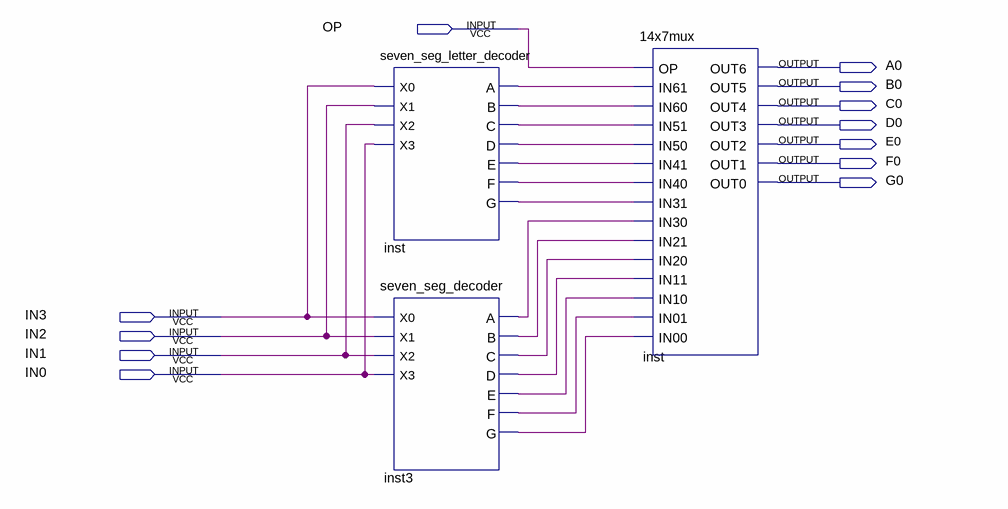
[diagram p0: schematic sheet]
// Quartus schematic 4BitDisplay.bdf as structural Verilog: 3 symbols, 12 pins
module \4BitDisplay  (
  input  OP,
  input  IN3,
  input  IN2,
  input  IN1,
  input  IN0,
  output A0,
  output B0,
  output C0,
  output D0,
  output E0,
  output F0,
  output G0
);

  wire inst3_a, inst3_b, inst3_c, inst3_d, inst3_e, inst3_f, inst3_g, inst_a, inst_b, inst_c, inst_d, inst_e,
       inst_f, inst_g;

  seven_seg_letter_decoder inst (
    .X0(IN3), .X1(IN2), .X2(IN1), .X3(IN0), .A(inst_a), .B(inst_b), .C(inst_c), .D(inst_d), .E(inst_e),
    .F(inst_f), .G(inst_g));
  seven_seg_decoder inst3 (
    .X0(IN3), .X1(IN2), .X2(IN1), .X3(IN0), .A(inst3_a), .B(inst3_b), .C(inst3_c), .D(inst3_d), .E(inst3_e),
    .F(inst3_f), .G(inst3_g));
  \14x7mux  inst_dup2 (
    .OP(OP), .IN61(inst_a), .IN60(inst_b), .IN51(inst_c), .IN50(inst_d), .IN41(inst_e), .IN40(inst_f),
    .IN31(inst_g), .IN30(inst3_a), .IN21(inst3_b), .IN20(inst3_c), .IN11(inst3_d), .IN10(inst3_e),
    .IN01(inst3_f), .IN00(inst3_g), .OUT6(A0), .OUT5(B0), .OUT4(C0), .OUT3(D0), .OUT2(E0), .OUT1(F0),
    .OUT0(G0));
endmodule
